# EAGLE design 32x_Ultimate_videoboard_7 (EAGLE 9.0.0)
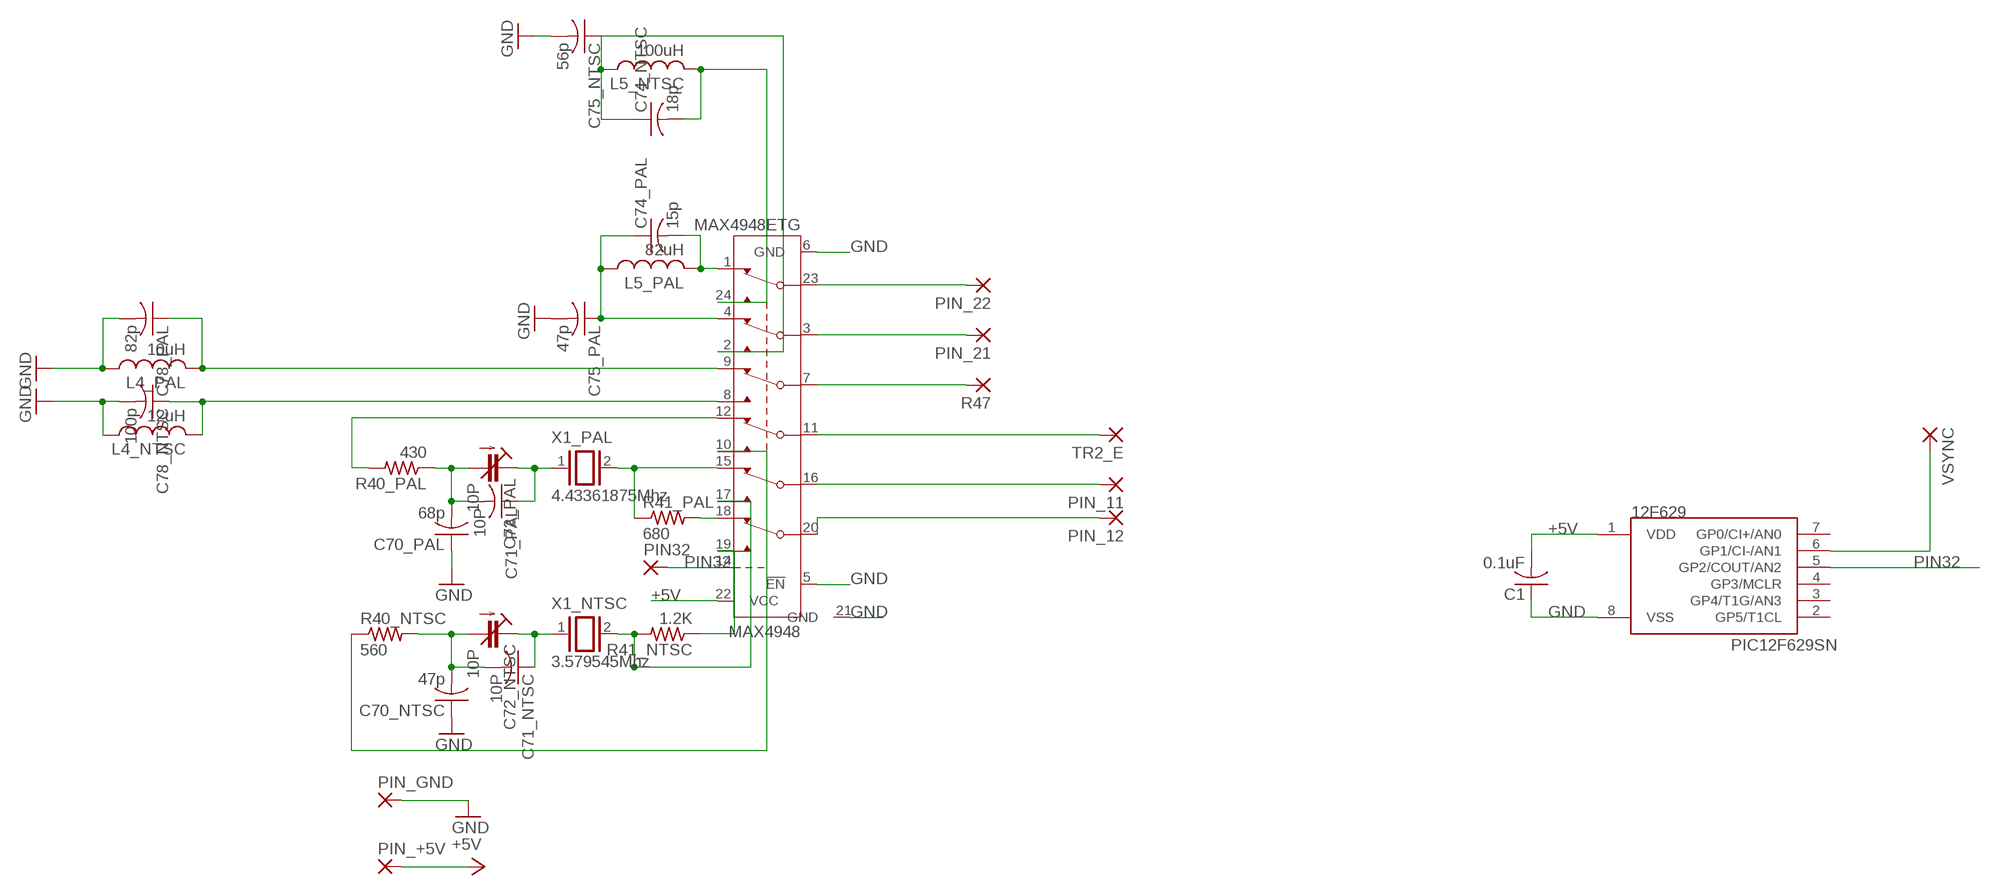
[diagram p0: schematic, sheet 1]

## Parts
12F629  PIC12F629SN  [SO-08]
C1  0.1uF  C-USC0603  [C0603]
C70_NTSC  47p  C-USC0603  [C0603]
C70_PAL  68p  C-USC0603  [C0603]
C71_NTSC  10P  C-USC0603  [C0603]
C71_PAL  10P  C-USC0603  [C0603]
C72_NTSC  10P  C-TRIMMTZBX4  [CTRIMTZBX4]
C72_PAL  10P  C-TRIMMTZBX4  [CTRIMTZBX4]
C74_NTSC  18p  C-USC0603  [C0603]
C74_PAL  15p  C-USC0603  [C0603]
C75_NTSC  56p  C-USC0603  [C0603]
C75_PAL  47p  C-USC0603  [C0603]
C78_NTSC  100p  C-USC0603  [C0603]
C78_PAL  82p  C-USC0603  [C0603]
L4_NTSC  12uH  L-USL2012C  [L2012C]
L4_PAL  10uH  L-USL2012C  [L2012C]
L5_NTSC  100uH  L-USL2012C  [L2012C]
L5_PAL  82uH  L-USL2012C  [L2012C]
MAX4948  MAX4948ETG  [TQFN24-EP]
PIN32  SMD2  [SMD1,27-2,54]
PIN_11  SMD2  [SMD1,27-2,54]
PIN_12  SMD2  [SMD1,27-2,54]
PIN_21  SMD2  [SMD1,27-2,54]
PIN_22  SMD2  [SMD1,27-2,54]
PIN_+5V  SMD5  [SMD2,54-5,08]
PIN_GND  SMD5  [SMD2,54-5,08]
R40_NTSC  560  R-US_R0603  [R0603]
R40_PAL  430  R-US_R0603  [R0603]
R41_NTSC  1.2K  R-US_R0603  [R0603]
R41_PAL  680  R-US_R0603  [R0603]
R47  SMD2  [SMD1,27-2,54]
TR2_E  SMD2  [SMD1,27-2,54]
VSYNC  SMD2  [SMD1,27-2,54]
X1_NTSC  3.579545Mhz  XTAL/S  [QS]
X1_PAL  4.43361875Mhz  XTAL/S  [QS]

## Nets
+5V: 12F629.1(VDD) C1.2 MAX4948.22(VCC) PIN_+5V.1(P)
GND: 12F629.8(VSS) C1.1 C70_NTSC.1 C70_PAL.1 C75_NTSC.2 C75_PAL.2 C78_NTSC.2 C78_PAL.2 L4_NTSC.1 L4_PAL.1 MAX4948.5(!EN) MAX4948.6(GND) MAX4948.21(GND) PIN_GND.1(P)
N$1: MAX4948.17(NO2) R41_NTSC.2 X1_NTSC.2
N$2: C70_NTSC.2 C71_NTSC.2 C72_NTSC.2(A) R40_NTSC.2
N$3: C71_NTSC.1 C72_NTSC.1(E) X1_NTSC.1
N$5: MAX4948.20(COM1) PIN_12.1(P)
N$7: MAX4948.11(COM3) TR2_E.1(P)
N$8: MAX4948.16(COM2) PIN_11.1(P)
N$9: MAX4948.18(NC1) R41_PAL.2
N$10: MAX4948.12(NC3) R40_PAL.2
N$11: MAX4948.19(NO1) R41_NTSC.1
N$12: MAX4948.7(COM4) R47.1(P)
N$13: C78_PAL.1 L4_PAL.2 MAX4948.9(NC4)
N$14: C74_PAL.1 C75_PAL.1 L5_PAL.1 MAX4948.4(NC5)
N$15: C70_PAL.2 C71_PAL.2 C72_PAL.2(A) R40_PAL.1
N$17: C71_PAL.1 C72_PAL.1(E) X1_PAL.1
N$18: 12F629.6(GP1/CI-/AN1) VSYNC.1(P)
N$19: C74_PAL.2 L5_PAL.2 MAX4948.1(NC6)
N$20: MAX4948.15(NC2) R41_PAL.1 X1_PAL.2
N$21: MAX4948.3(COM5) PIN_21.1(P)
N$22: MAX4948.23(COM6) PIN_22.1(P)
N$23: MAX4948.10(NO3) R40_NTSC.1
N$24: C74_NTSC.1 C75_NTSC.1 L5_NTSC.1 MAX4948.2(NO5)
N$25: C78_NTSC.1 L4_NTSC.2 MAX4948.8(NO4)
N$28: C74_NTSC.2 L5_NTSC.2 MAX4948.24(NO6)
PIN32: 12F629.5(GP2/COUT/AN2) MAX4948.14(CB) PIN32.1(P)
Unconnected: 12F629.2(GP5/T1CL) 12F629.3(GP4/T1G/AN3) 12F629.4(GP3/MCLR) 12F629.7(GP0/CI+/AN0) MAX4948.EXP

## Library data of the parts
12F629 = microchip-5:PIC12F6*: uPC nW 1k Program Flash memory 2x Timer Comparator 10b A/D converter/ 4xIN
C1 C70_NTSC C70_PAL C71_NTSC C71_PAL C74_NTSC C74_PAL C75_NTSC C75_PAL C78_NTSC C78_PAL = resistor:C-US: CAPACITOR, American symbol
C72_NTSC = rcl:C-TRIMM: Trimm capacitor
C72_PAL = resistor:C-TRIMM: Trimm capacitor
L4_NTSC L4_PAL L5_NTSC L5_PAL = resistor:L-US: INDUCTOR, American symbol
MAX4948 = maxim:MAX4948ETG: Hex SPDT Data Switch Source: http://datasheets.maxim-ic.com/en/ds/MAX4947-MAX4948.pdf; MPN: MAX4948ETG+; OC_FARNELL: unknown; OC_NEWARK: 42M5624
PIN32 PIN_11 PIN_12 PIN_21 PIN_22 R47 TR2_E VSYNC = wirepad:SMD2: SMD PAD
PIN_+5V PIN_GND = wirepad:SMD5: SMD PAD
R40_NTSC R40_PAL R41_NTSC R41_PAL = resistor:R-US_: RESISTOR, American symbol
X1_NTSC X1_PAL = special:XTAL/S: CRYSTAL

## Board
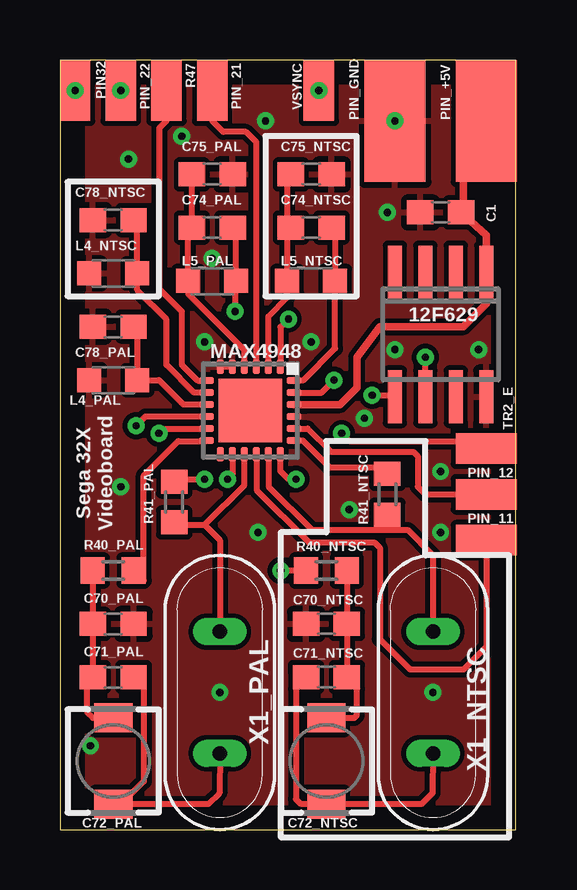
[diagram p1: board, top side]
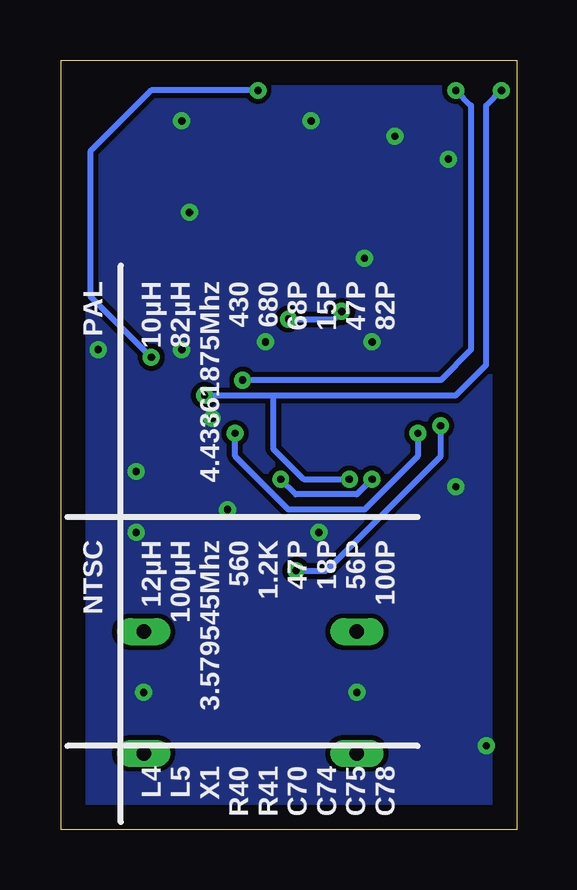
[diagram p2: board, bottom side, seen from below]

Size 19 x 32.06 mm. Coordinates in mm from the lower left corner, seen from the top.
Outline: 0,0 19,0 19,32.06 0,32.06 0,0
Copper layers (1*16): Top 0.035mm / dielectric 1.5mm / Bottom 0.035mm
Design rules "default *": minimum track width 10mil, minimum drill 24mil, track to track 8mil, track to pad 8mil, pad to pad 8mil, via to via 8mil, smd to smd 8mil, copper to edge 40mil, drill to drill 8mil, minimum pad ring 10mil, minimum via ring 8mil, stop-mask expansion 4mil, vias tented up to drill 0mil, thermal gap 10mil

### Footprints (pad centres in the part's own frame; a part is rotated, then mirrored left to right if it is on the bottom)
SO-08 = smd 0.6 x 2.2: 1 -1.905,-2.6; 2 -0.635,-2.6; 3 0.635,-2.6; 4 1.905,-2.6; 5 1.905,2.6; 6 0.635,2.6; 7 -0.635,2.6; 8 -1.905,2.6
C0603 = smd 1.1 x 1: 1 -0.85,0; 2 0.85,0
CTRIMTZBX4 = smd 1.6 x 1.2: 1 0,1.8; 2 0,-1.8
L2012C = smd 1 x 1: 1 -1,0; 2 1,0
TQFN24-EP = smd 0.6 x 0.3: 1 -1.825,1.25; 2 -1.825,0.75; 3 -1.825,0.25; 4 -1.825,-0.25; 5 -1.825,-0.75; 6 -1.825,-1.25; 13 1.825,-1.25; 14 1.825,-0.75; 15 1.825,-0.25; 16 1.825,0.25; 17 1.825,0.75; 18 1.825,1.25 | smd 0.3 x 0.6: 7 -1.25,-1.825; 8 -0.75,-1.825; 9 -0.25,-1.825; 10 0.25,-1.825; 11 0.75,-1.825; 12 1.25,-1.825; 19 1.25,1.825; 20 0.75,1.825; 21 0.25,1.825; 22 -0.25,1.825; 23 -0.75,1.825; 24 -1.25,1.825 | smd 2.63 x 2.63: EXP 0,0
SMD1,27-2,54 = smd 1.27 x 2.54: 1 0,0
SMD2,54-5,08 = smd 2.54 x 5.08: 1 0,0
R0603 = smd 1 x 1.1: 1 -0.85,0; 2 0.85,0
QS = drill 0.61 long: 1 -2.54,0; 2 2.54,0

### Placement (x,y rotation side)
12F629  15.88,20.64 180 top
C1  15.88,25.72 0 top
C70_NTSC  11.11,8.57 0 top
C70_PAL  2.22,8.57 180 top
C71_NTSC  11.11,6.35 0 top
C71_PAL  2.22,6.35 180 top
C72_NTSC  11.11,2.86 180 top
C72_PAL  2.22,2.86 180 top
C74_NTSC  10.48,25.08 0 top
C74_PAL  6.35,25.08 0 top
C75_NTSC  10.48,27.3 0 top
C75_PAL  6.35,27.3 0 top
C78_NTSC  2.22,25.4 180 top
C78_PAL  2.22,20.95 180 top
L4_NTSC  2.22,23.18 0 top
L4_PAL  2.22,18.73 0 top
L5_NTSC  10.48,22.86 0 top
L5_PAL  6.35,22.86 0 top
MAX4948  7.94,17.46 270 top
PIN32  0.64,30.8 180 top
PIN_11  17.78,12.07 270 top
PIN_12  17.78,13.97 90 top
PIN_21  6.35,30.8 0 top
PIN_22  2.54,30.8 0 top
PIN_+5V  17.78,29.53 180 top
PIN_GND  13.97,29.53 180 top
R40_NTSC  11.11,10.8 0 top
R40_PAL  2.22,10.8 0 top
R41_NTSC  13.65,13.97 270 top
R41_PAL  4.76,13.65 90 top
R47  4.45,30.8 0 top
TR2_E  17.78,15.88 90 top
VSYNC  10.79,30.8 0 top
X1_NTSC  15.56,5.71 90 top
X1_PAL  6.67,5.71 90 top

### Tracks (layer width: path | path; a pad name or v marks a point on that pad's centre or on a via)
+5V
  Top 0.254: C1.2 17.14,25.72
  Top 0.305: PIN_+5V.1 16.82,28.57 16.82,26.03 16.51,25.72 C1.2 17.78,24.76 12F629.1 17.78,21.91 16.83,20.95 13.34,20.95 12.38,19.68 12.38,18.41 11.68,17.71 MAX4948.22
GND  (via drill 0.3)
  Top 0.254: MAX4948.5 MAX4948.6
  other vias: 17.46,20 13.97,29.53 6.03,20.32 8.57,29.53 10.48,20.32 6.67,5.71 15.56,5.71 2.54,14.29 5.08,28.89 6.35,23.81 12.06,13.34 15.88,12.38 8.26,12.38 12.7,17.14 2.86,27.94 1.27,3.49 15.88,14.92 13.65,25.72 13.97,20
  pour Bottom: -0.64,32.7 19.68,32.7 19.68,-0.63 -0.64,-0.63
  pour Top: -0.64,32.7 19.68,32.7 19.68,-0.63 -0.64,-0.63
N$1
  Top 0.254: X1_NTSC.2 15.56,11.43 14.5,12.48 13.65,12.48 | MAX4948.17 8.71,14.98 8.71,14.29 10.51,12.48 13.65,12.48 | 13.65,12.7 R41_NTSC.2 13.65,12.48
N$2
  Top 0.254: R40_NTSC.2 C70_NTSC.2 C71_NTSC.2 | C71_NTSC.2 11.96,6.14 | C72_NTSC.2 12.28,4.66 12.38,4.76 12.38,6.03 C71_NTSC.2
N$3
  Top 0.254: C71_NTSC.1 9.84,6.56 9.84,1.27 10.05,1.06 C72_NTSC.1 15.07,1.06 15.54,1.52 X1_NTSC.1
N$5
  Top 0.254: PIN_12.1 15.24,13.97 14.92,14.29 14.92,15.56 14.74,15.74 11.31,15.74 10.33,16.71 MAX4948.20
N$7  (via drill 0.3)
  Top 0.254: v4.13,16.51 4.24,16.71 MAX4948.11 | 17.46,16.19 TR2_E.1 17.47,15.87 17.16,16.19 12.06,16.19 v11.75,16.51
  Bottom 0.254: v4.13,16.51 4.13,15.56 6.35,13.34 9.53,13.34 11.75,15.56 v11.75,16.51
N$8
  Top 0.254: MAX4948.16 8.21,14.98 8.21,14.15 10.38,11.97 13.11,11.97 13.34,11.75 13.34,7.94 14.61,6.67 16.83,6.67 17.78,7.62 PIN_11.1
N$9  (via drill 0.3)
  Top 0.254: v9.84,14.61 9.53,14.61 9.19,14.94 MAX4948.18 | R41_PAL.2 4.76,14.61 v6.03,14.61
  Bottom 0.254: v6.03,14.61 6.67,13.97 9.21,13.97 v9.84,14.61
N$10
  Top 0.254: MAX4948.12 6.09,16.19 4.94,16.19 3.49,14.75 3.49,10.37 R40_PAL.2
N$11
  Top 0.254: 10.94,15.42 10.92,15.42 | MAX4948.19 10.13,16.21 10.92,15.42 | 10.92,15.42 11.24,15.1 13.15,15.1 R41_NTSC.1
N$12
  Top 0.254: R47.1 4.45,29.53 4.15,29.24 4.15,22.52 5.08,21.59 5.08,19.38 5.75,18.71 MAX4948.7
N$13
  Top 0.254: C78_PAL.1 3.22,20.8 L4_PAL.2 4.13,18.73 5.15,17.71 MAX4948.9
N$14
  Top 0.254: L5_PAL.1 5.35,24.93 C74_PAL.1 C75_PAL.1 | MAX4948.4 7.67,19.31 7.67,20 5.35,22.32 L5_PAL.1 | L5_PAL.1 5.35,22.91
N$15
  Top 0.254: R40_PAL.1 C70_PAL.2 C71_PAL.2 1.37,6.14 1.14,5.91 1.14,4.89 1.38,4.66 C72_PAL.2
N$17
  Top 0.254: C72_PAL.1 2.54,1.06 | 2.54,1.06 6.18,1.06 6.65,1.52 X1_PAL.1 | C71_PAL.1 3.49,6.56 3.49,2.01 2.54,1.06
N$18  (via drill 0.3)
  Top 0.254: 12F629.6 v15.24,19.68
  Bottom 0.254: VSYNC.1 15.24,30.8 17.78,28.26 17.78,22.23 v15.24,19.68
  other vias: 10.79,30.8
N$19  (via drill 0.3)
  Top 0.254: C74_PAL.2 7.35,24.93 L5_PAL.2 7.3,23.13 v7.3,21.59 | v9.53,21.27 9.19,20.93 MAX4948.1
  Bottom 0.254: v9.53,21.27 7.62,21.27 v7.3,21.59
N$20
  Top 0.254: 4.86,12.48 R41_PAL.1 4.76,12.7 6.03,12.7 | 6.03,12.7 6.67,12.07 X1_PAL.2 | 6.03,12.7 7.69,14.36 MAX4948.15
N$21
  Top 0.254: PIN_21.1 6.35,29.53 6.81,29.07 7.76,29.07 8.19,28.64 MAX4948.3 8.21,19.31
N$22  (via drill 0.3)
  Top 0.254: MAX4948.23 10.91,18.21 v11.43,18.73
  Bottom 0.254: PIN_22.1 1.91,30.16 1.91,20 3.17,18.73 v11.43,18.73
  other vias: 2.54,30.8
N$23  (via drill 0.3)
  Top 0.254: MAX4948.10 3.81,17.21 3.74,17.21 3.56,17.21 v3.17,16.83 | R40_NTSC.1 v9.21,10.8
  Bottom 0.254: v9.21,10.8 7.94,10.8 3.17,15.56 v3.17,16.83
N$24
  Top 0.254: C74_NTSC.1 9.48,25.25 | 9.48,25.25 L5_NTSC.1 9.48,22.18 8.69,21.39 MAX4948.2 | C75_NTSC.1 9.48,27.47 9.48,25.25
N$25
  Top 0.254: C78_NTSC.1 3.22,25.25 L4_NTSC.2 3.22,22.48 4.45,21.26 4.45,19.37 5.6,18.21 MAX4948.8
N$28
  Top 0.254: C74_NTSC.2 11.48,25.25 L5_NTSC.2 11.48,20.05 10.16,18.73 9.78,18.73 MAX4948.24
PIN32  (via drill 0.3)
  Top 0.254: MAX4948.14 7.19,14.81 v6.99,14.61 | v13.02,18.1 13.97,18.1 12F629.5
  Bottom 0.254: 10.16,18.1 2.54,18.1 1.27,19.37 1.27,30.16 PIN32.1 | v6.99,14.61 8.89,14.61 10.16,15.87 10.16,18.1 | v13.02,18.1 10.16,18.1
  other vias: 0.64,30.8

### Text on the board
tNames: Sega 32X / Videoboard
bNames: PAL / / 10µH / 82µH / 4.43361875Mhz / 430 / 680 / 68P / 15P / 47P / 82P | NTSC / / 12µH / 100µH / 3.579545Mhz / 560 / 1.2K / 47P / 18P / 56P / 100P | L4 / L5 / X1 / R40 / R41 / C70 / C74 / C75 / C78